# Altium project Rectifier_Buck.PrjPcb
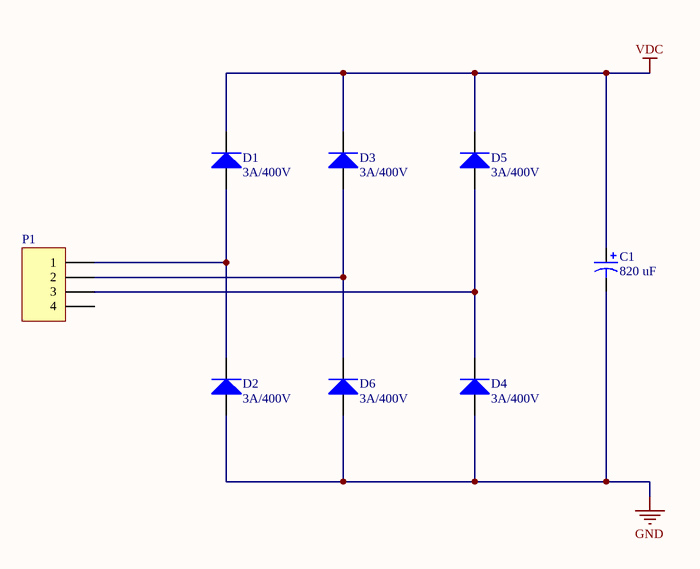
[diagram p0: Rectifier.SchDoc]
2 sheets, 34 parts. Net scope: global (net labels, ports and power ports of the same name join across sheets).
Board file: rectifier_buck_pcb.PcbDoc
Sheets:
  Rectifier.SchDoc
  Buck.SchDoc

## Sheet Rectifier.SchDoc
size A4; DocumentNumber: 1; SheetNumber: 1; SheetTotal: 2

### Parts
C1  value 820 uF  [ESMQ401VSN821MA45S]  (hidden comment: ESMQ401VSN821MA45S)
D1  value 3A/400V  [DO201AD]  (hidden comment: DIODE GEN PURP 400V 3A DO201AD - 1N5404)
D2  value 3A/400V  [DO201AD]  (hidden comment: DIODE GEN PURP 400V 3A DO201AD - 1N5404)
D3  value 3A/400V  [DO201AD]  (hidden comment: DIODE GEN PURP 400V 3A DO201AD - 1N5404)
D4  value 3A/400V  [DO201AD]  (hidden comment: DIODE GEN PURP 400V 3A DO201AD - 1N5404)
D5  value 3A/400V  [DO201AD]  (hidden comment: DIODE GEN PURP 400V 3A DO201AD - 1N5404)
D6  value 3A/400V  [DO201AD]  (hidden comment: DIODE GEN PURP 400V 3A DO201AD - 1N5404)
P1  CTB9358/4AO  [CTB9350/4AO]  (value not drawn)

### Nets
GND: C1.2 D2.1(A) D4.1(A) D6.1(A)
VDC: C1.1 D1.2(K) D3.2(K) D5.2(K)
NetD1_1: D1.1(A) D2.2(K) P1.1
NetD3_1: D3.1(A) D6.2(K) P1.2
NetD4_2: D4.2(K) D5.1(A) P1.3

Not connected (* = marked no-connect by the designer): P1 4

### Library data of the parts
C1 = ESMQ401VSN821MA45S: CAP ALUM 820UF 20% 400V SNAP; Published: 25.10.2016; LatestRevisionDate: -; Publisher: Baris; PackageDescription: Polarized Capacitor; 2 Leads; Supplier: Digikey; Supplier No: 565-2783-ND
D1-D6 = DIODE GEN PURP 400V 3A DO201AD - 1N5404: DIODE GEN PURP 400V 3A DO201AD; Manufacturer: DIODES INC.; Manufacturer Part Name: 1N5404-T; Code: 3040173; Family: DIODE; Package Reference: DO201AD; Supplier: Digikey; Supplier No: 1N5404DITR-ND
P1 = CTB9358/4AO: 4 pos plıggable terminal; LatestRevisionDate: 19.05.2016; Publisher: Sinan

## Sheet Buck.SchDoc
size A4; DocumentNumber: 2; SheetNumber: 2; SheetTotal: 2
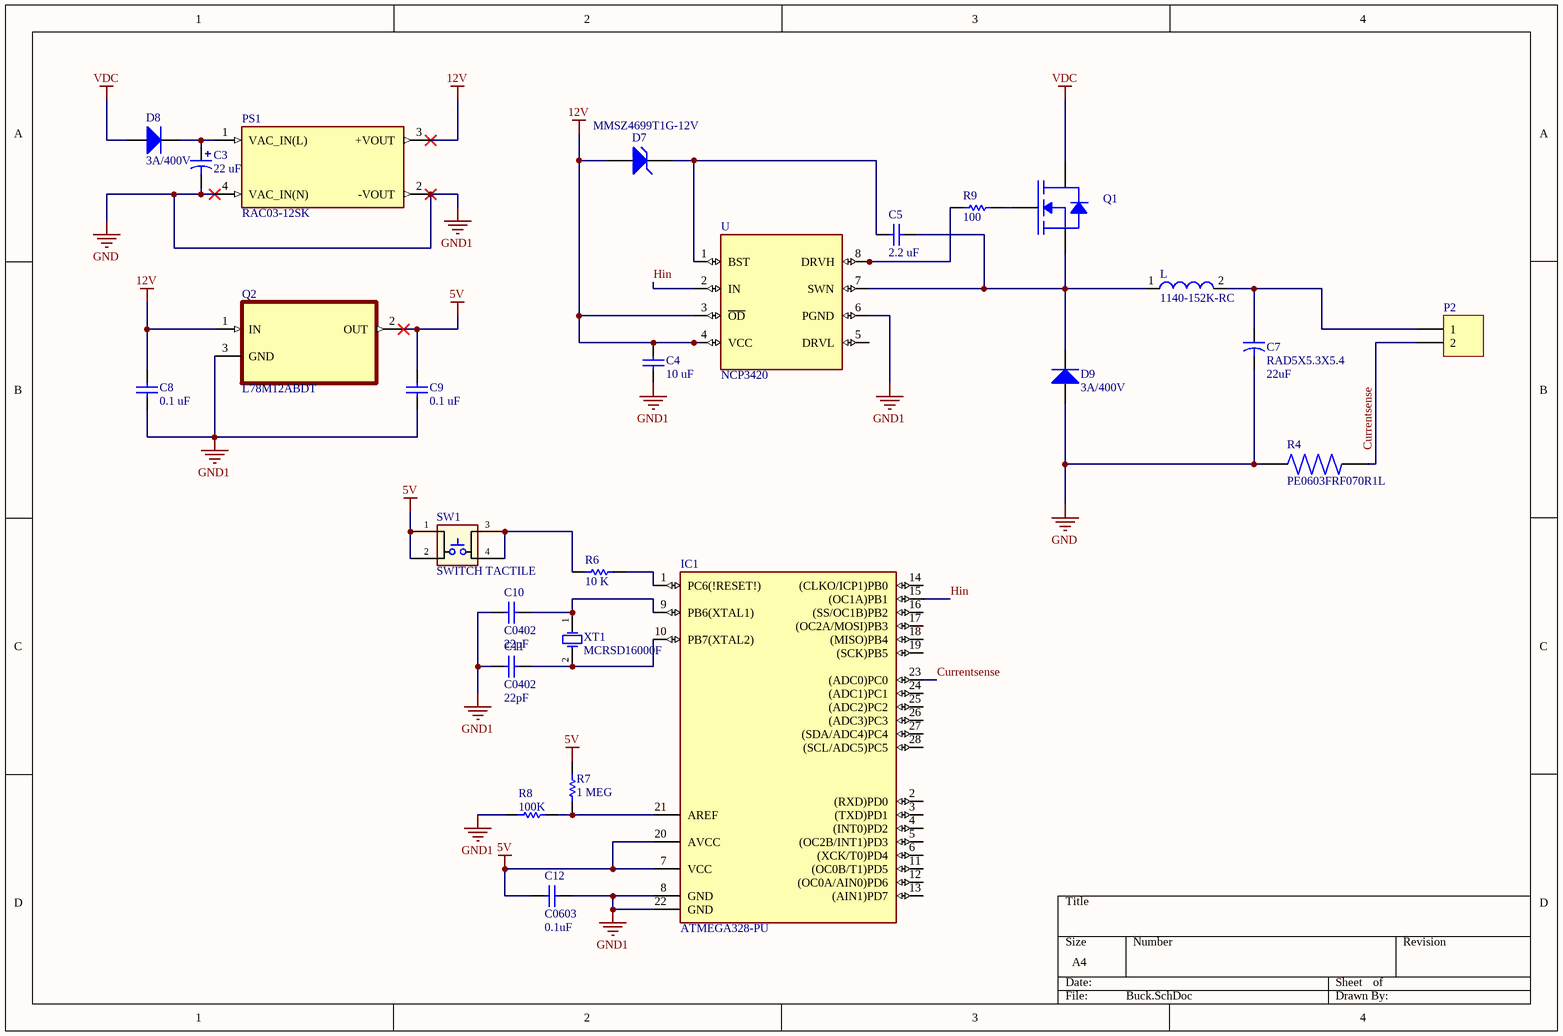
[diagram p1: Buck.SchDoc]

### Parts
C3  value 22 uF  [CAP-12.25X25]  (hidden comment: EEUED2G220)
C4  value 10 uF  [1206]  (hidden comment: MC1206B106K160CT)
C5  value 2.2 uF  [0805]  (hidden comment: C2012X7R1C225K)
C7  value 22uF  Package Reference: RAD5X5.3X5.4  [RAD5.3X5.3X5.0]  (hidden comment: CAP ALUM 22UF 20% 35V SMD 5X5.3X5.4)
C8  value 0.1 uF  [0603]  (hidden comment: *Value)
C9  value 0.1 uF  [0603]  (hidden comment: *Value)
C10  value 22pF  Package Reference: C0402  [C0402N]  (hidden comment: CAP CER 22PF 5% 50V NP0 SMD 0402)
C11  value 22pF  Package Reference: C0402  [C0402N]  (hidden comment: CAP CER 22PF 5% 50V NP0 SMD 0402)
C12  value 0.1uF  Package Reference: C0603  [C0603N]  (hidden comment: CAP CER 0.1UF 10% 16V X7R SMD 0603)
D7  MMSZ4699T1G-12V  [SOD123]
D8  value 3A/400V  [DO201AD]  (hidden comment: DIODE GEN PURP 400V 3A DO201AD - 1N5404)
D9  value 3A/400V  [DO201AD]  (hidden comment: DIODE GEN PURP 400V 3A DO201AD - 1N5404)
IC1  ATMEGA328-PU  [DIL28]
L  1140-152K-RC  [INDRD2921W163D3810H2616P]
P2  Konnektör  [250-202]  (value not drawn)
PS1  RAC03-12SK  [CONV_RAC03-12SK]
Q1  LSIC1MO120E0080  [TO-247-3L]  (value not drawn)
Q2  L78M12ABDT  [TO225P972X240-3N]
R4  PE0603FRF070R1L  [RESC1507X55N]
R6  value 10 K  [0603]  (hidden comment: ERJ3GEYJ103V)
R7  value 1 MEG  [0603]  (hidden comment: Resistor)
R8  value 100K  [0603]  (hidden comment: MC0063W06031100K)
R9  value 100  [1206]  (hidden comment: *Value)
SW1  SWITCH TACTILE  [SWITCH_TACHTILE_SMD]
U  NCP3420  [SO08]
XT1  value MCRSD16000F  [XTAL_11.4MMX 4.7MM]  (hidden comment: CRYSTAL 16MHZ 18PF)

### Nets
5V: C9.2 C12.1 IC1.7(VCC) IC1.20(AVCC) Q2.2(OUT) R7.2 SW1.1 SW1.2
12V: C4.1 C8.2 D7.1(A) PS1.3(+VOUT) Q2.1(IN) U.3(~{OD}) U.4(VCC)
GND: C3.2 C4.2 C7.2 C8.1 C9.1 C10.1 C11.1 C12.2 D9.1(A) IC1.8(GND) IC1.22(GND) PS1.2(-VOUT) PS1.4(VAC_IN(N)) Q2.3(GND) R4.2 R8.2 U.6(PGND)  [also labelled GND1]
VDC: D8.1(A) Q1.2(D(Tab))
Currentsense: IC1.23((ADC0)PC0) P2.2 R4.1
Hin: IC1.15((OC1A)PB1) U.2(IN)
NetC3_1: C3.1 D8.2(K) PS1.1(VAC_IN(L))
NetC5_1: C5.1 D7.2(K) U.1(BST)
NetC5_2: C5.2 D9.2(K) L.1 Q1.3(S) U.7(SWN)
NetC7_1: C7.1 L.2 P2.1
NetC10_2: C10.2 IC1.9(PB6(XTAL1)) XT1.1(OSC1)
NetC11_2: C11.2 IC1.10(PB7(XTAL2)) XT1.2(OSC2)
NetIC1_1: IC1.1(PC6(!RESET!)) R6.1
NetIC1_21: IC1.21(AREF) R7.1 R8.1
NetQ1_1: Q1.1(G) R9.2
NetR6_2: R6.2 SW1.3 SW1.4
NetR9_1: R9.1 U.8(DRVH)

Not connected (* = marked no-connect by the designer): IC1 2((RXD)PD0) 3((TXD)PD1) 4((INT0)PD2) 5((OC2B/INT1)PD3) 6((XCK/T0)PD4) 11((OC0B/T1)PD5) 12((OC0A/AIN0)PD6) 13((AIN1)PD7) 14((CLKO/ICP1)PB0) 16((SS/OC1B)PB2) 17((OC2A/MOSI)PB3) 18((MISO)PB4) 19((SCK)PB5) 24((ADC1)PC1) 25((ADC2)PC2) 26((ADC3)PC3) 27((SDA/ADC4)PC4) 28((SCL/ADC5)PC5); U 5(DRVL)

### Library data of the parts
C3 = EEUED2G220: 22 uF Electrlytic capacitor; Published: 8-Jun-2000; LatestRevisionDate: 17-Jul-2002; Publisher: Altium Limited; PackageDescription: Polarized Capacitor; 2 Leads; Package Reference: POLAR0.8; Supplier: Farnell; Supplier No: 9696482
C4 = MC1206B106K160CT: 10 uF X7R Ceremic Capacitor; Published: 29.10.2015; LatestRevisionDate: 29.10.2015; Publisher: Sinan; PackageDescription: 1206[3216] package smd
C5 = C2012X7R1C225K: 2.2 uF X7R Ceremic Capacitor; Tolerance: %10; Published: 10.03.2016; LatestRevisionDate: 10.03.2016; Publisher: Sinan; PackageDescription: 0805[2012] package smd; Supplier: Farnell; Supplier No: 2148625
C7 = CAP ALUM 22UF 20% 35V SMD 5X5.3X5.4: Manufacturer: PANASONIC; Manufacturer Part Name: EEE-HA1V220WR; Code: 3020079; Family: CAP; Supplier: Digikey; Supplier No: PCE4240CT-ND
C8 C9 = C0603C104K3RACTU: 0.1uF X7R Ceramic Capacitor; Tolerance: %5; Published: 14.05.2016; Publisher: Baris; PackageDescription: 0603[1608] package smd; Supplier: Farnell; Supplier No: 1650835
C10 C11 = CAP CER 22PF 5% 50V NP0 SMD 0402: Manufacturer: SAMSUNG ELECTRO; Manufacturer Part Name: CL05C220JB5NGNC; Code: 3020045; Family: CAP; Supplier: Digikey; Supplier No: 1276-6529-2-ND
C12 = CAP CER 0.1UF 10% 16V X7R SMD 0603: Manufacturer: MURATA; Manufacturer Part Name: GCM188R71C104KA37D; Code: 3020148; Family: CAP; Supplier: Mouser; Supplier No: 81-GCM188R71C104KA7J
D7 = MMSZ4699T1G: DIODE ZENER 12V 500MW SOD123; Published: 20.09.2019; Publisher: Baris; Supplier No: MMSZ4699T1GOSTR-ND
D8 D9 = DIODE GEN PURP 400V 3A DO201AD - 1N5404: as D1 on sheet Rectifier; Family: DIODE; Package Reference: DO201AD; Supplier: Digikey; Supplier No: 1N5404DITR-ND
IC1 = ATMEGA328-PU: AVR AVRÂ® ATmega Microcontroller IC 8-Bit 20MHz 32KB _16K x 16_ FLASH 28-PDIP; MF: Microchip Technology; Value: ***; Package: DIP-28 Microchip Technology; Price: None; Availability: Unavailable; MP: ATMEGA328-PU; SnapEDA_Link: https://www.snapeda.com/parts/ATMEGA328-PU/Microchip/view-part/4327846/?ref=snap
L = 1140-152K-RC: 1.5mH Unshielded Wirewound Inductor 2.9A 324mOhm Max Radial; MF: Bourns; SnapEDA_Link: https://www.snapeda.com/parts/1140-152K-RC/Bourns%20-%20J.W.%20Miller/view-part/314350/?ref=snap; Value: *; MP: 1140-152K-RC; Availability: Unavailable; Package: Radial Bourns; Price: None
P2 = 250-202: 2 pos power connector; LatestRevisionDate: 21.11.2015; Publisher: Sinan
PS1 = RAC03-12SK: Enclosed AC DC Converters 1 Uitgang 12V 250mA 85 ~ 264 VAC, 120 ~ 370 VDC Input; MF: Recom Power; SnapEDA_Link: https://www.snapeda.com/parts/RAC03-12SK/Recom%20Power/view-part/4176661/?ref=snap; Availability: Unavailable; Value: *; Price: None; MP: RAC03-12SK; Package: DIP-4 Recom Power
Q1 = LSIC1MO120E0080: LittleFuse SIC mosfet; Published: 15.09.2019; LatestRevisionDate: 15.09.2019; Publisher: Baris; Package Reference: TO-247-3L; Supplier: Mouser; Supplier No: 576-LSICMO120E0080
Q2 = L78M12ABDT: Linear Voltage Regulator IC 1 Output 500mA DPAK; MF: STMicroelectronics; SnapEDA_Link: https://www.snapeda.com/parts/L78M12ABDT/STMicroelectronics/view-part/564226/?ref=snap; Price: None; Availability: Unavailable; MP: L78M12ABDT; Value: *; Package: DPAK STMicroelectronics
R6 = ERJ3GEYJ103V: 10k ohm 0603 package resistor; Tolerance: 5%; Montaj Bilgisi: Otomatik; Published: 28.10.2015; LatestRevisionDate: 28.10.2015; Publisher: Sinan; PackageDescription: Surface mount 0603 package; Package Reference: 0603; Supplier: Digi-Key; Supplier No: P10KGTR-ND
R7 = MC0063W060311M: 1 MEG ohm 0603 package resistor; Montaj Bilgisi: Auto; Published: 16.06.2016; Publisher: Sinan; PackageDescription: 0603 [1608]; Supplier: Farnell; Supplier No: 2141580
R8 = MC0063W06031100K: 100Kohm 0603package resistor; Montaj Bilgisi: Auto; Published: 14.04.2016; Publisher: Baris; PackageDescription: 0603 [1608]; Supplier: Farnell; Supplier No: 9330402
R9 = MC0125W12061100R: 100 ohm 1206 package resistor; Montaj Bilgisi: Auto; Published: 14.04.2016; Publisher: Baris; PackageDescription: 1206 [3216]; Supplier: Farnell; Supplier No: 9335749
SW1 = SWITCH TACTILE: SWITCH TACTILE (SPST NO) TOP ACTUATED SURFACE MOUNT; Manufacturer: C&K Components; Manufacturer Part Name: PTS645SM43SMTR92 LFS; Code: 3050091; Family: SWITCH; Supplier: Digikey; Supplier No: CKN9112CT-ND; Value: SWITCH TACTILE
U = NCP3420: ON Semiconductor TSMC 12V FET DRVR; Availability: Bad; Check_prices: https://www.snapeda.com/parts/NCP3420/ON%20Semiconductor/view-part/5003082/?ref=eda; Value: *; Package: None; MF: ON Semiconductor; Price: None; SnapEDA_Link: https://www.snapeda.com/parts/NCP3420/ON%20Semiconductor/view-part/5003082/?ref=snap; MP: NCP3420
XT1 = CRYSTAL 16MHZ 18PF: Manufacturer: MULTICOMP; Manufacturer Part Name: MCRSD16000F183000RR; Code: 3040032; Family: XTAL; Package Reference: SMD 11.4MMX 4.7MM; Supplier: Farnell; Supplier No: 2395958
R4 = PE0603FRF070R1L: Package: None; Price: None; Value: *; MP: PE0603FRF070R1L; Availability: Unavailable

## Nets that join several sheets
GND: Rectifier (C1.2 D2.1 D4.1 D6.1), Buck (17 pins)
VDC: Rectifier (C1.1 D1.2 D3.2 D5.2), Buck (D8.1 Q1.2)